# Altium schematic sheet Altium_3_v03_01_GLUE_LOGIC_4Plane_P3.schdoc
size 309 x 223 mm; Symbol: Sheet-Symbol_A4; Device: Sheet-Symbol_A4; @Project Name: The20c_v03; @Page Count: 3; @Update Date: 2026-09-12; @Create Date: 2026-09-12; @Schematic Name: v03_01_GLUE_LOGIC_4Plane; @Page No: 3; @Page Name: v03_01_GLUE_LOGIC_4Plane_P3; Company: OsoLabs.tech; Reviewed: OsoLabs; Version: v03_01; Page Size: A4; Part Number: v03_01_GLUE_LOGIC; Drawn: OsoLabs; @Board Name: v03_01_GLUE_LOGIC_4Plane; @Create Time: 14:47:21; @Update Time: 12:10:51
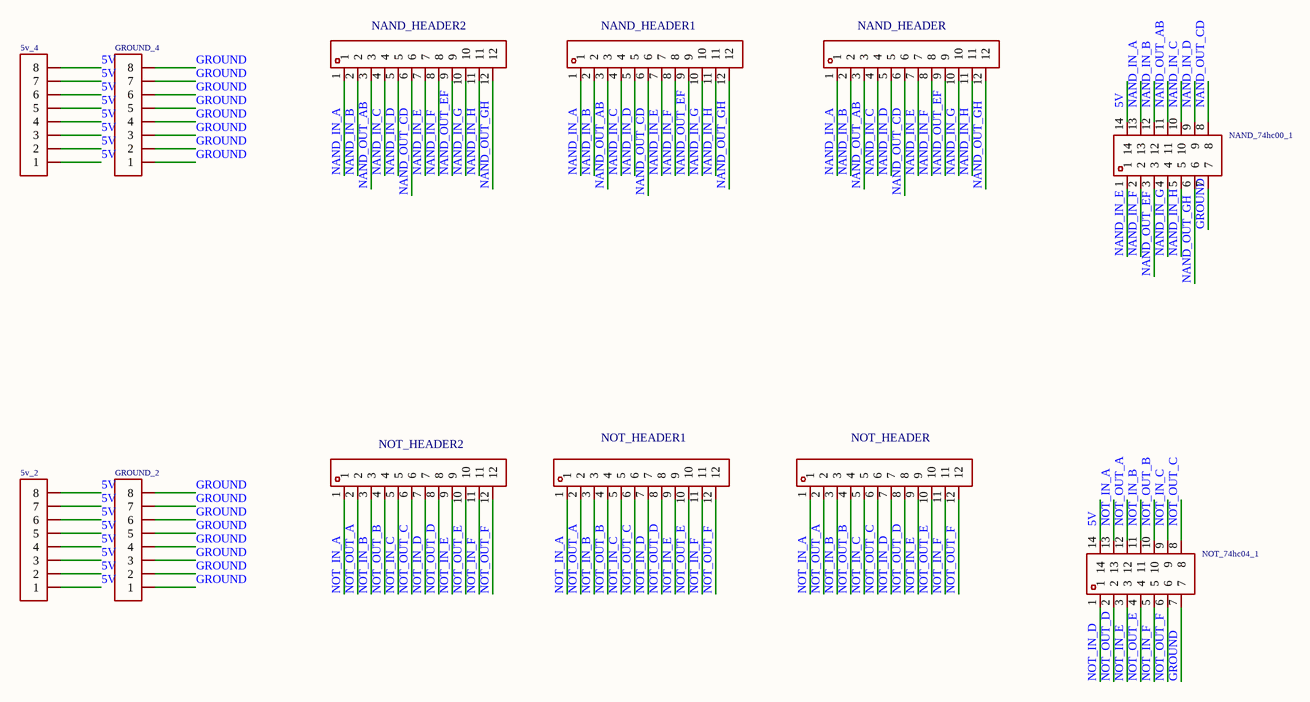
[diagram p0: Altium_3_v03_01_GLUE_LOGIC_4Plane_P3.schdoc]

## Parts
5v_2  2.54-1*8P母环保  [HDR-TH_8P-P2.54-V-F-1]  (value not drawn)
5v_4  2.54-1*8P母环保  [HDR-TH_8P-P2.54-V-F-1]  (value not drawn)
GROUND_2  2.54-1*8P母环保  [HDR-TH_8P-P2.54-V-F-1]  (value not drawn)
GROUND_4  2.54-1*8P母环保  [HDR-TH_8P-P2.54-V-F-1]  (value not drawn)
NAND_74hc00_1  IC-14P窄  [DIP-14_L17.8-W10.2-P2.54-BL]  (value not drawn)
NAND_HEADER  PM254-1-12-Z-8.5  [HDR-TH_12P-P2.54-V-F]  (value not drawn)
NAND_HEADER1  PM254-1-12-Z-8.5  [HDR-TH_12P-P2.54-V-F]  (value not drawn)
NAND_HEADER2  PM254-1-12-Z-8.5  [HDR-TH_12P-P2.54-V-F]  (value not drawn)
NOT_74hc04_1  IC-14P窄  [DIP-14_L17.8-W10.2-P2.54-BL]  (value not drawn)
NOT_HEADER  PM254-1-12-Z-8.5  [HDR-TH_12P-P2.54-V-F]  (value not drawn)
NOT_HEADER1  PM254-1-12-Z-8.5  [HDR-TH_12P-P2.54-V-F]  (value not drawn)
NOT_HEADER2  PM254-1-12-Z-8.5  [HDR-TH_12P-P2.54-V-F]  (value not drawn)

## Nets
5V: 5v_2.1 5v_2.2 5v_2.3 5v_2.4 5v_2.5 5v_2.6 5v_2.7 5v_2.8 5v_4.1 5v_4.2 5v_4.3 5v_4.4 5v_4.5 5v_4.6 5v_4.7 5v_4.8 NAND_74hc00_1.14 NOT_74hc04_1.14
GROUND: GROUND_2.1 GROUND_2.2 GROUND_2.3 GROUND_2.4 GROUND_2.5 GROUND_2.6 GROUND_2.7 GROUND_2.8 GROUND_4.1 GROUND_4.2 GROUND_4.3 GROUND_4.4 GROUND_4.5 GROUND_4.6 GROUND_4.7 GROUND_4.8 NAND_74hc00_1.7 NOT_74hc04_1.7
NAND_IN_A: NAND_74hc00_1.13 NAND_HEADER.1 NAND_HEADER1.1 NAND_HEADER2.1
NAND_IN_B: NAND_74hc00_1.12 NAND_HEADER.2 NAND_HEADER1.2 NAND_HEADER2.2
NAND_IN_C: NAND_74hc00_1.10 NAND_HEADER.4 NAND_HEADER1.4 NAND_HEADER2.4
NAND_IN_D: NAND_74hc00_1.9 NAND_HEADER.5 NAND_HEADER1.5 NAND_HEADER2.5
NAND_IN_E: NAND_74hc00_1.1 NAND_HEADER.7 NAND_HEADER1.7 NAND_HEADER2.7
NAND_IN_F: NAND_74hc00_1.2 NAND_HEADER.8 NAND_HEADER1.8 NAND_HEADER2.8
NAND_IN_G: NAND_74hc00_1.4 NAND_HEADER.10 NAND_HEADER1.10 NAND_HEADER2.10
NAND_IN_H: NAND_74hc00_1.5 NAND_HEADER.11 NAND_HEADER1.11 NAND_HEADER2.11
NAND_OUT_AB: NAND_74hc00_1.11 NAND_HEADER.3 NAND_HEADER1.3 NAND_HEADER2.3
NAND_OUT_CD: NAND_74hc00_1.8 NAND_HEADER.6 NAND_HEADER1.6 NAND_HEADER2.6
NAND_OUT_EF: NAND_74hc00_1.3 NAND_HEADER.9 NAND_HEADER1.9 NAND_HEADER2.9
NAND_OUT_GH: NAND_74hc00_1.6 NAND_HEADER.12 NAND_HEADER1.12 NAND_HEADER2.12
NOT_IN_A: NOT_74hc04_1.13 NOT_HEADER.1 NOT_HEADER1.1 NOT_HEADER2.1
NOT_IN_B: NOT_74hc04_1.11 NOT_HEADER.3 NOT_HEADER1.3 NOT_HEADER2.3
NOT_IN_C: NOT_74hc04_1.9 NOT_HEADER.5 NOT_HEADER1.5 NOT_HEADER2.5
NOT_IN_D: NOT_74hc04_1.1 NOT_HEADER.7 NOT_HEADER1.7 NOT_HEADER2.7
NOT_IN_E: NOT_74hc04_1.3 NOT_HEADER.9 NOT_HEADER1.9 NOT_HEADER2.9
NOT_IN_F: NOT_74hc04_1.5 NOT_HEADER.11 NOT_HEADER1.11 NOT_HEADER2.11
NOT_OUT_A: NOT_74hc04_1.12 NOT_HEADER.2 NOT_HEADER1.2 NOT_HEADER2.2
NOT_OUT_B: NOT_74hc04_1.10 NOT_HEADER.4 NOT_HEADER1.4 NOT_HEADER2.4
NOT_OUT_C: NOT_74hc04_1.8 NOT_HEADER.6 NOT_HEADER1.6 NOT_HEADER2.6
NOT_OUT_D: NOT_74hc04_1.2 NOT_HEADER.8 NOT_HEADER1.8 NOT_HEADER2.8
NOT_OUT_E: NOT_74hc04_1.4 NOT_HEADER.10 NOT_HEADER1.10 NOT_HEADER2.10
NOT_OUT_F: NOT_74hc04_1.6 NOT_HEADER.12 NOT_HEADER1.12 NOT_HEADER2.12

## Notes on the sheet
- 1
- 2
- 3
- 4
- 5
- 6
- A
- B
- C
- Schematic
- v03_01_GLUE_LOGIC_4Plane
- Create Date
- Update Date
- 2026-09-12
- Reviewed
- Drawn
- Page
- OsoLabs
- v03_01_GLUE_LOGIC_4Plane_P3
- Part Number
- The20c_v03
- v03_01_GLUE_LOGIC
- D
- VER
- SIZE
- PAGE
- OF
- v03_01
- A4
- OsoLabs.tech

## Library data of the parts
5v_2 5v_4 GROUND_2 GROUND_4 = 2.54-1*8P母环保: Manufacturer: BOOMELE(博穆精密); Symbol: Header-Female-2.54_1x8; Add into BOM: yes; Holes Structure: 1x8P; Pitch: 2.54mm; Number of Holes: 8P; Device: 2.54-1*8P母环保; Supplier: LCSC; Manufacturer Part: 2.54-1*8P母环保; Supplier Part: C27438; JLCPCB Part Class: Extended Part; LCSC Part Name: 间距:2.54mm 1x8P 直插; Supplier Footprint: 插件,P=2.54mm; Datasheet: https://atta.szlcsc.com/upload/public/pdf/source/20231221/1CA800C6799ED97958773716FAA1BFFE.pdf; Convert to PCB: yes; Row Spacing: -; Mounting Type: Straight; Number of Rows: Plugin; Insulation Height: -; Contact Material: -; Contact Plating: -
NAND_74hc00_1 NOT_74hc04_1 = IC-14P窄: Manufacturer: BOOMELE(博穆精密); Symbol: IC seat 14P; Add into BOM: yes; IC Type: DIP; Pitch: 2.54mm; Row Spacing: 7.62mm; Number of Positions: 14P; Device: IC-14P窄; Supplier: LCSC; Supplier Part: C2325; Manufacturer Part: IC-14P窄; JLCPCB Part Class: Extended Part; LCSC Part Name: 间距2.54mm P数:14P; Supplier Footprint: DIP-14; Datasheet: https://atta.szlcsc.com/upload/public/pdf/source/20151118/1457707579760.pdf; Convert to PCB: yes; Contact Plating: -
NAND_HEADER NAND_HEADER1 NAND_HEADER2 NOT_HEADER NOT_HEADER1 NOT_HEADER2 = PM254-1-12-Z-8.5: Manufacturer: HCTL(华灿天禄); Add into BOM: yes; Holes Structure: 1x12P; Pitch: 2.54mm; Circular Hole / Square Hole: Square Holes; Number of Holes: 12P; Current Rating (Max): 3A; Holes Direction: Top; Soldering Temperature(Max): 260℃@5S; Symbol: PM254-1-12-Z-8.5; Device: PM254-1-12-Z-8.5; LCSC Part Name: 1x12P 间距:2.54mm 直插; Supplier Part: C2897375; Manufacturer Part: PM254-1-12-Z-8.5; Supplier Footprint: 插件,P=2.54mm; JLCPCB Part Class: Extended Part; Datasheet: https://atta.szlcsc.com/upload/public/pdf/source/20230609/534BE42964C679BDE98E061007C4ABD6.pdf; Supplier: LCSC; Convert to PCB: yes; Row Spacing: -; Mounting Type: Straight; Number of Rows: Plugin; Voltage Rating (Max): -; Insulation Height: 8.5mm; Contact Material: Copper Alloy; Operating Temperature Range: -40℃~+105℃